# EAGLE schematic DiffAmp_PCB (EAGLE 7.2.0)
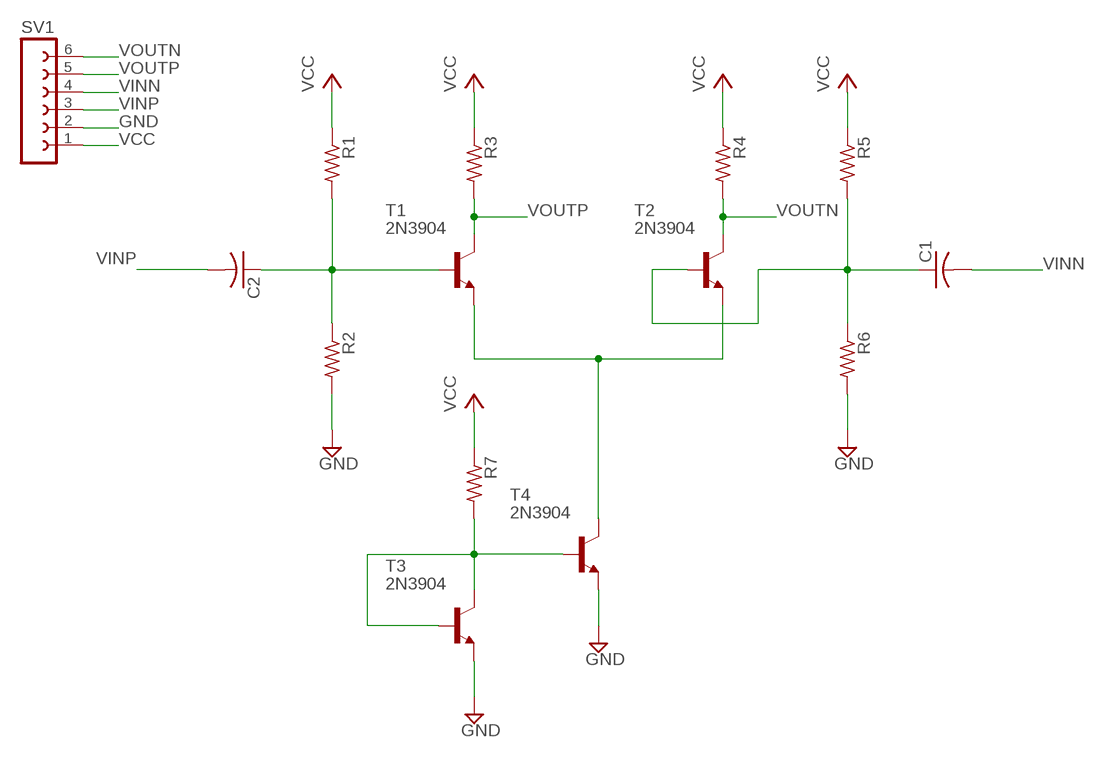
[diagram p0: schematic, sheet 1]

## Parts
C1  C-USC0805  [C0805]
C2  C-USC0805  [C0805]
R1  R-US_R0805  [R0805]
R2  R-US_R0805  [R0805]
R3  R-US_R0805  [R0805]
R4  R-US_R0805  [R0805]
R5  R-US_R0805  [R0805]
R6  R-US_R0805  [R0805]
R7  R-US_R0805  [R0805]
SV1  FE06-1  [FE06]
T1  2N3904  [TO92]
T2  2N3904  [TO92]
T3  2N3904  [TO92]
T4  2N3904  [TO92]

## Nets
GND: R2.2 R6.2 SV1.2 T3.3(E) T4.3(E)
N$1: T1.3(E) T2.3(E) T4.1(C)
N$2: C1.1 R5.2 R6.1 T2.2(B)
N$3: R7.2 T3.1(C) T3.2(B) T4.2(B)
N$8: C2.1 R1.2 R2.1 T1.2(B)
VCC: R1.1 R3.1 R4.1 R5.1 R7.1 SV1.1
VINN: C1.2 SV1.4
VINP: C2.2 SV1.3
VOUTN: R4.2 SV1.6 T2.1(C)
VOUTP: R3.2 SV1.5 T1.1(C)

## Library data of the parts
C1 C2 = adafruit:C-US: CAPACITOR, American symbol
R1-R7 = adafruit:R-US_: RESISTOR, American symbol
SV1 = con-lsta:FE06-1: FEMALE HEADER; OC_FARNELL: unknown; OC_NEWARK: unknown
T1-T4 = transistor:2N3904: NPN TRANSISTOR